# Altium schematic sheet Boost converter.SchDoc
size 297 x 209 mm; DocumentNumber: 1; SheetNumber: 1; SheetTotal: 1
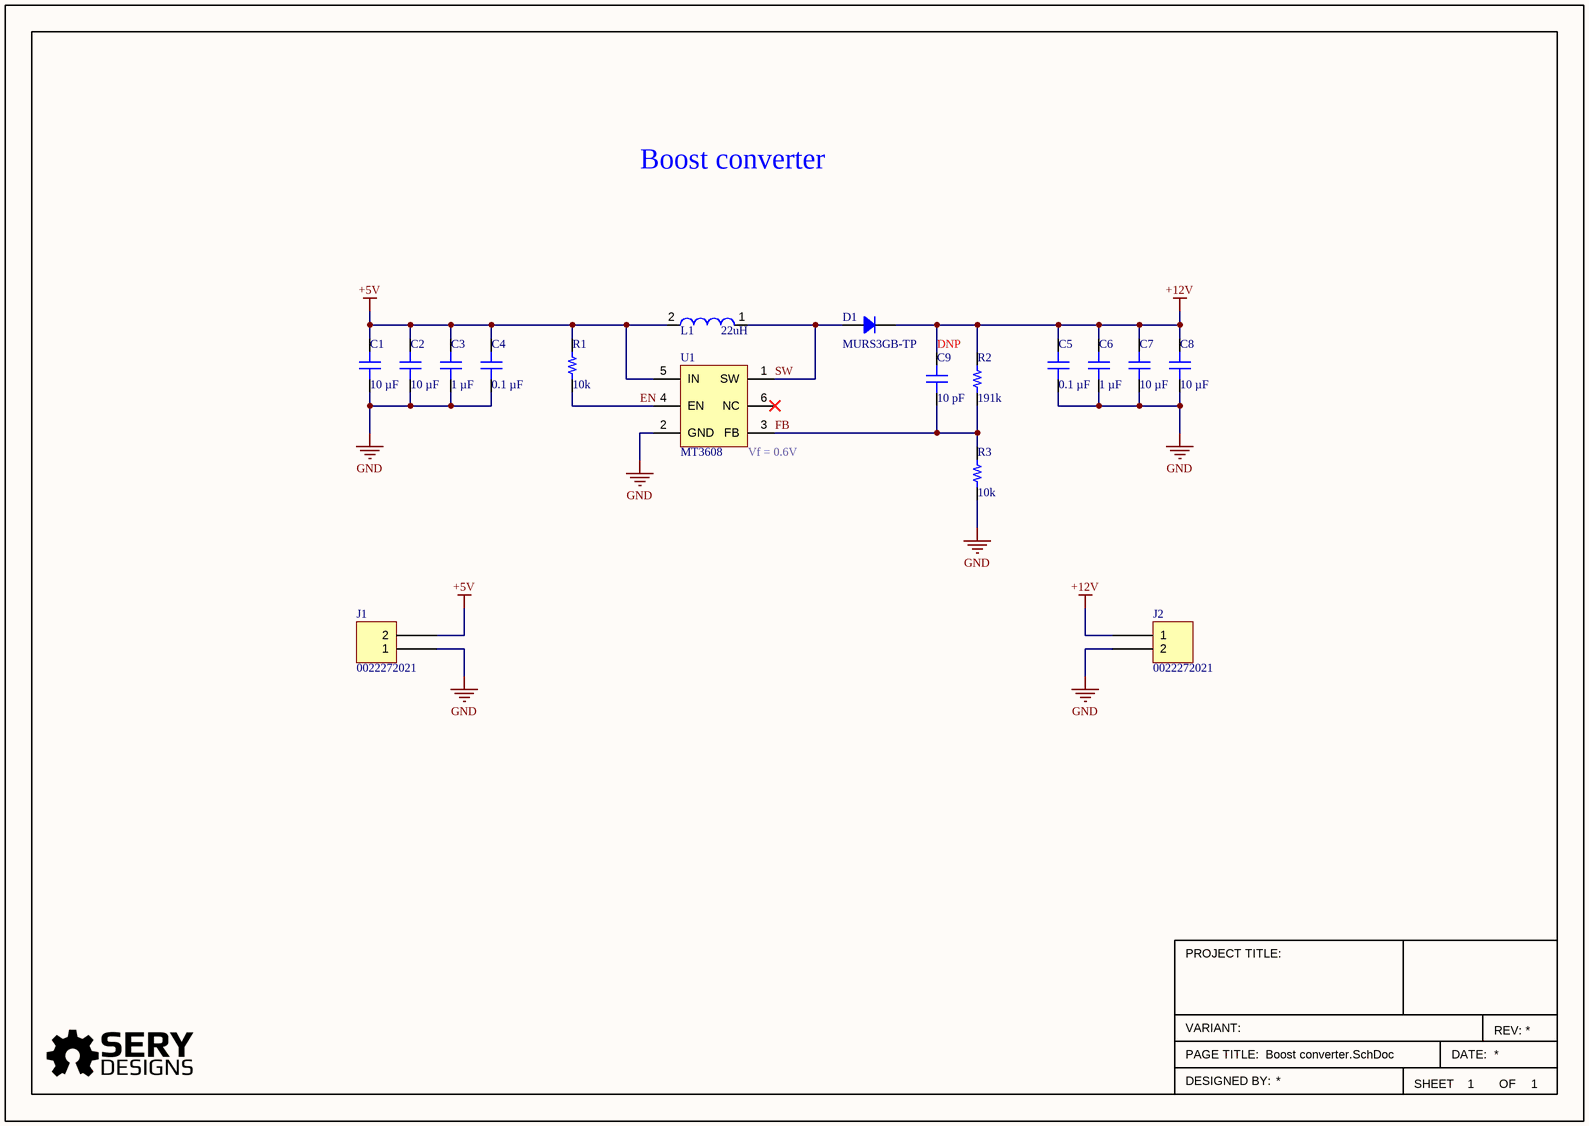
[diagram p0: Boost converter.SchDoc]

## Parts
C1  10 µF  [CAP 0805_2012]
C2  10 µF  [CAP 0805_2012]
C3  1 µF  [CAP 0603_1608]
C4  0.1 µF  [CAP 0402_1005]
C5  0.1 µF  [CAP 0402_1005]
C6  1 µF  [CAP 0603_1608]
C7  10 µF  [CAP 0805_2012]
C8  10 µF  [CAP 0805_2012]
C9  10 pF  [CAP 0402_1005]
D1  MURS3GB-TP  [DO214AA SMB]
J1  0022272021  [MOLEX KK 0022272021]
J2  0022272021  [MOLEX KK 0022272021]
L1  22uH  [NRS8040T220MJGJV]
OSHW-logo1  OSHW-logo  [OSHW-logo]  (value not drawn)  (no BOM)
R1  10k  [RES 0402_1005]
R2  191k  [RES 0402_1005]
R3  10k  [RES 0402_1005]
SeryDesigns-logo1  SeryDesigns-logo  [SeryDesigns-logo]  (value not drawn)  (no BOM)
U1  MT3608  [SOT23-6]

## Nets
+5V: C1.2 C2.2 C3.2 C4.2 J1.2 L1.2 R1.2 U1.5(IN)
+12V: C5.2 C6.2 C7.2 C8.2 C9.2 D1.2 J2.1 R2.2
GND: C1.1 C2.1 C3.1 C4.1 C5.1 C6.1 C7.1 C8.1 J1.1 J2.2 R3.1 U1.2(GND)
EN: R1.1 U1.4(EN)
FB: C9.1 R2.1 R3.2 U1.3(FB)
SW: D1.1 L1.1 U1.1(SW)

Not connected (* = marked no-connect by the designer): U1 6(NC)*

## Notes on the sheet
- Boost converter
- (near C9) DNP
- (near U1) Vf = 0.6V
- PROJECT TITLE:
- VARIANT:
- PAGE TITLE:
- SHEET
- DATE:
- REV:
- OF
- DESIGNED BY:

## Library data of the parts
C1 C2 C7 C8 = GRM21BR61H106ME43L: CAP CER 10UF 50V X5R 0805; manufacturer: Murata Electronics; Tolerance: ±20%; Part Number: GRM21BR61H106ME43L; Value: 10 µF; Applications: General Purpose; Capacitance: 10 µF; componentlink1description: Datasheet; componentlink1url: https://search.murata.co.jp/Ceramy/image/img/A01X/G101/ENG/GRM21BR61H106ME43-01A.pdf; componentlink2description: DigiKey Link; componentlink2url: https://www.digikey.com/en/products/detail/murata-electronics/GRM21BR61H106ME43L/10326317; Device Package: 0805 (2012 Metric); lastupdated: 9/19/2022 1:04:12 PM; Lifecycle Status: Active; Minimum Order: 1; Mounting Type: Surface Mount, MLCC; Operating Temperature: -55°C ~ 85°C; Package / Case: 0805 (2012 Metric); packaging: TapeAndReel; partid: 41295; Part Status: Active; price: 0.08; series: GRM; Size / Dimension: 0.079" L x 0.049" W (2.00mm x 1.25mm); Supplier 1: DigiKey; Supplier Part Number 1: 490-18664-1-ND; Temperature Coefficient: X5R; Thickness (Max): 0.057" (1.45mm); Voltage - Rated: 50V
C3 C6 = UMK107AB7105KA-T: CAP CER 1UF 50V X7R 0603; manufacturer: Taiyo Yuden; Tolerance: ±10%; Part Number: UMK107AB7105KA-T; Value: 1 µF; Applications: SMPS Filtering; Capacitance: 1 µF; componentlink1description: Datasheet; componentlink1url: https://www.yuden.co.jp/productdata/catalog/mlcc01_e.pdf; componentlink2description: DigiKey Link; componentlink2url: https://www.digikey.com/en/products/detail/taiyo-yuden/UMK107AB7105KA-T/3660085; Device Package: 0603 (1608 Metric); lastupdated: 9/19/2022 1:00:51 PM; Lifecycle Status: Active; Minimum Order: 1; Mounting Type: Surface Mount, MLCC; Operating Temperature: -55°C ~ 125°C; Package / Case: 0603 (1608 Metric); packaging: TapeAndReel; partid: 46688; Part Status: Active; price: 0.04; series: M; Size / Dimension: 0.063" L x 0.031" W (1.60mm x 0.80mm); Supplier 1: DigiKey; Supplier Part Number 1: 587-3247-1-ND; Temperature Coefficient: X7R; Thickness (Max): 0.037" (0.95mm); Voltage - Rated: 50V
C4 C5 = CGA2B3X7R1H104M050BB: CAP CER 0.1UF 50V X7R 0402; manufacturer: TDK Corporation; Tolerance: ±20%; Part Number: CGA2B3X7R1H104M050BB; Value: 0.1 µF; Applications: Automotive; Capacitance: 0.1 µF; componentlink1description: Datasheet; componentlink1url: https://product.tdk.com/info/en/catalog/datasheets/mlcc_automotive_general_en.pdf?ref_disty=digikey; componentlink2description: DigiKey Link; componentlink2url: https://www.digikey.com/en/products/detail/tdk-corporation/CGA2B3X7R1H104M050BB/3949507; Device Package: 0402 (1005 Metric); lastupdated: 9/19/2022 12:57:29 PM; Lifecycle Status: Active; Minimum Order: 1; Mounting Type: Surface Mount, MLCC; Operating Temperature: -55°C ~ 125°C; Package / Case: 0402 (1005 Metric); packaging: TapeAndReel; partid: 45577; Part Status: Active; price: 0.01; Ratings: AEC-Q200; series: CGA; Size / Dimension: 0.039" L x 0.020" W (1.00mm x 0.50mm); Supplier 1: DigiKey; Supplier Part Number 1: 445-12271-1-ND; Temperature Coefficient: X7R; Thickness (Max): 0.022" (0.55mm); Voltage - Rated: 50V
C9 = CL05C100JB5NNNC: CAP CER 10PF 50V C0G/NP0 0402; manufacturer: Samsung Electro-Mechanics; Temperature Coefficient: C0G, NP0; Tolerance: ±5%; Part Number: CL05C100JB5NNNC; Value: 10 pF; Applications: General Purpose; Capacitance: 10 pF; componentlink1description: Datasheet; componentlink1url: http://www.samsungsem.com/kr/support/product-search/mlcc/CL05C100JB5NNNC.jsp; componentlink2description: DigiKey Link; componentlink2url: https://www.digikey.com/en/products/detail/samsung-electro-mechanics/CL05C100JB5NNNC/3886797; Device Package: 0402 (1005 Metric); lastupdated: 9/19/2022 12:57:22 PM; Lifecycle Status: Active; Minimum Order: 1; Mounting Type: Surface Mount, MLCC; Operating Temperature: -55°C ~ 125°C; Package / Case: 0402 (1005 Metric); packaging: TapeAndReel; partid: 6120; Part Status: Active; price: 0.01; series: CL; Size / Dimension: 0.039" L x 0.020" W (1.00mm x 0.50mm); Supplier 1: DigiKey; Supplier Part Number 1: 1276-1139-1-ND; Thickness (Max): 0.022" (0.55mm); Voltage - Rated: 50V
D1 = MURS3GB-TP: 3A,400V, SUPER FAST RECOVERY REC; Manufacturer: Micro Commercial Co; Capacitance @ Vr, F: 40pF @ 4V, 1MHz; Current - Reverse Leakage @ Vr: 5 µA @ 400 V; Diode Type: Standard; Reverse Recovery Time (trr): 35 ns; Speed: Fast Recovery =< 500ns, > 200mA (Io); Voltage - Forward (Vf) (Max) @ If: 1 V @ 3 A; Part Number: MURS3GB-TP; ComponentLink1Description: Datasheet; ComponentLink1URL: https://www.mccsemi.com/pdf/Products/MURS3GB(SMB)-B.pdf; ComponentLink2Description: DigiKey Link; ComponentLink2URL: https://www.digikey.com/en/products/detail/micro-commercial-co/MURS3GB-TP/8554681; Current - Average Rectified (Io): 3A; LastUpdated: 9/19/2022 1:45:41 PM; Lifecycle Status: Active; Minimum Order: 1; Mounting Type: Surface Mount; Operating Temperature - Junction: -55°C ~ 150°C; Package / Case: DO-214AA, SMB; Packaging: TapeAndReel; PartId: 108; Part Status: Active; Price: 0.13; Series: -; Supplier 1: DigiKey; Supplier Part Number 1: MURS3GB-TPMSCT-ND; Supplier Device Package: DO-214AA (SMB); Voltage - DC Reverse (Vr) (Max): 400 V
J1 J2 = 0022272021: CONN HEADER VERT 2POS 2.54MM; Manufacturer: Molex; Contact Length - Mating: 0.295" (7.49mm); Contact Length - Post: 0.140" (3.56mm); Material Flammability Rating: UL94 V-0; Number of Positions: 2; Number of Positions Loaded: All; Overall Contact Length: 0.560" (14.22mm); Pitch - Mating: 0.100" (2.54mm); Shrouding: Shrouded - 1 Wall; Style: Board to Cable/Wire; Part Number: 0022272021; ComponentLink1Description: Datasheet; ComponentLink1URL: https://www.molex.com/pdm_docs/sd/022272021_sd.pdf; ComponentLink2Description: DigiKey Link; ComponentLink2URL: http://digikey.com/product-detail/en/molex/0022272021/WM4111-ND/1130577; Connector Type: Header; Contact Finish - Mating: Tin; Contact Finish - Post: Tin; Contact Finish Thickness - Mating: 100.0µin (2.54µm); Contact Material: Brass; Contact Shape: Square; Contact Type: Male Pin; Fastening Type: Friction Lock; Insulation Color: Natural; Insulation Height: 0.461" (11.70mm); Insulation Material: Polyamide (PA), Nylon; LastUpdated: 1/12/2020 11:51:43 PM; Lifecycle Status: Active; Minimum Order: 1; Mounting Type: Through Hole; Number of Rows: 1; Packaging: Bulk; PartId: 76; Part Status: Active; Price: 0.27; Series: KK 6410; Supplier 1: DigiKey; Supplier Part Number 1: WM4111-ND; Termination: Solder
L1 = NRS8040T220MJGJV: Inductor, Fixed, SMD, 22µH, 2.2A; Part Number: 6006M0220F000; MF: Taiyo Yuden; Tolerance: ±20%; Temp Range: -40°C ~ 125°C; MPN: NRS8040T220MJGJV; Family: Inductors (Fixed); Package: Custom SMT; Value: 22µH; Power: N/A; Voltage: N/A; Special: N/A; Mount Type: SMT; Supplier 1: Digi-Key; Supplier Part Number 1: 587-3655-2-ND; Current: 2.2A; ComponentLink1Description: Datasheet; ComponentLink1URL: https://ds.yuden.co.jp/TYCOMPAS/ut/detail?pn=LCXNH8080YKL220MJG&u=M
OSHW-logo1 = OSHW-logo: OSHW logo, no writing
R1 R3 = RE0402FRE0710KL: RES SMD 10K OHM 1% 1/16W 0402; Manufacturer: Yageo; Power (Watts): 0.063W, 1/16W; Resistance: 10 kOhms; Temperature Coefficient: ±50ppm/°C; Part Number: RE0402FRE0710KL; Value: 10k; ComponentLink1Description: Datasheet; ComponentLink1URL: https://www.yageo.com/upload/media/product/productsearch/datasheet/rchip/PYu-RE_105_RoHS_L_6.pdf; ComponentLink2Description: DigiKey Link; ComponentLink2URL: https://www.digikey.com/en/products/detail/yageo/RE0402FRE0710KL/5922980; Composition: Thick Film; Device Package: 0402 (1005 Metric); Height - Seated (Max): 0.015" (0.37mm); LastUpdated: 9/19/2022 1:13:38 PM; Lifecycle Status: Active; Minimum Order: 1; Number of Terminations: 2; Operating Temperature: -55°C ~ 155°C; Package / Case: 0402 (1005 Metric); Packaging: CutTape; PartId: 68060; Part Status: Active; Price: 0.01; Series: RE; Size / Dimension: 0.039" L x 0.020" W (1.00mm x 0.50mm); Supplier 1: DigiKey; Supplier Part Number 1: 13-RE0402FRE0710KLCT-ND; Supplier Device Package: 0402; Tolerance: ±1%
R2 = AC0402FR-07191KL: RES SMD 191K OHM 1% 1/16W 0402; Manufacturer: Yageo; Power (Watts): 0.063W, 1/16W; Resistance: 191 kOhms; Temperature Coefficient: ±100ppm/°C; Part Number: AC0402FR-07191KL; Value: 191k; ComponentLink1Description: Datasheet; ComponentLink1URL: https://www.yageo.com/upload/media/product/productsearch/datasheet/rchip/PYu-AC_51_RoHS_L_8.pdf; ComponentLink2Description: DigiKey Link; ComponentLink2URL: https://www.digikey.com/en/products/detail/yageo/AC0402FR-07191KL/5895119; Composition: Thick Film; Device Package: 0402 (1005 Metric); Features: Automotive AEC-Q200, Moisture Resistant; Height - Seated (Max): 0.015" (0.37mm); LastUpdated: 9/19/2022 1:13:54 PM; Lifecycle Status: Active; Minimum Order: 1; Number of Terminations: 2; Operating Temperature: -55°C ~ 155°C; Package / Case: 0402 (1005 Metric); Packaging: CutTape; PartId: 60441; Part Status: Active; Price: 0.01; Ratings: AEC-Q200; Series: AC; Size / Dimension: 0.039" L x 0.020" W (1.00mm x 0.50mm); Supplier 1: DigiKey; Supplier Part Number 1: 13-AC0402FR-07191KLCT-ND; Supplier Device Package: 0402; Tolerance: ±1%
SeryDesigns-logo1 = SeryDesigns-logo: Sery designs logo